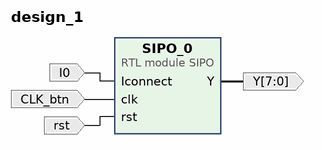
[diagram p0: block diagram of the top level]
# Vivado block design design_1, xc7z007sclg400-1, Vivado 2024.1.1
create_bd_design design_1

create_bd_port -dir I CLK_btn
create_bd_port -dir I rst
create_bd_port -dir O -from 7 -to 0 Y
create_bd_port -dir I I0

create_bd_cell -type module -reference SIPO SIPO_0

# ---- connections ----

connect_bd_net -net I0_1 [get_bd_ports I0] [get_bd_pins SIPO_0/Iconnect]
connect_bd_net [get_bd_pins SIPO_0/Y] [get_bd_ports Y]
connect_bd_net -net clk_1 [get_bd_ports CLK_btn] [get_bd_pins SIPO_0/clk]
connect_bd_net [get_bd_ports rst] [get_bd_pins SIPO_0/rst]

validate_bd_design
save_bd_design
